# Altium project Relay via transistor.PrjPcb
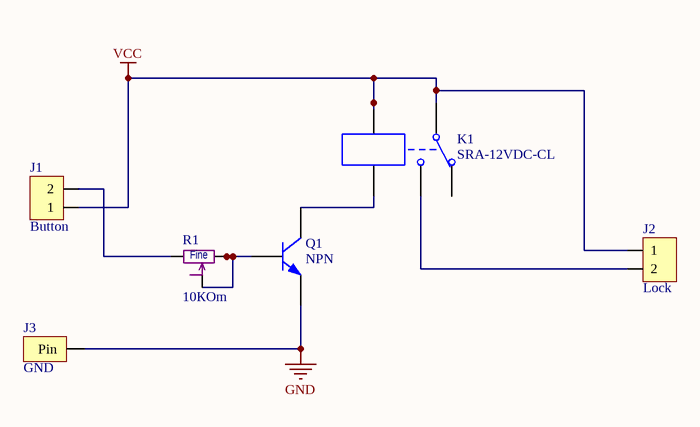
[diagram p0: Relay via transistor.SchDoc]
1 sheet, 6 parts. Net scope: global (net labels, ports and power ports of the same name join across sheets).
Board file: Relay via transistor.PcbDoc

## Sheet Relay via transistor.SchDoc
size A4

### Parts
J1  Button  [Molex Micro-Fit 3.0 - 2 pin D R]
J2  Lock  [Molex Micro-Fit 3.0 - 2 pin D R]
J3  GND  [OnePin 1.2x3]
K1  SRA-12VDC-CL  [SRA-12VDC-CL]
Q1  NPN  [TO-92 2.54 (EBC)]
R1  10КOm  [Res Adj 3362P]

### Nets
GND: J3.1(Pin) Q1.E
VCC: J1.1 J2.1 K1.2 K1.4
NetJ1_2: J1.2 R1.1
NetJ2_2: J2.2 K1.3
NetK1_5: K1.5 Q1.C
NetQ1_B: Q1.B R1.2 R1.3

Not connected (* = marked no-connect by the designer): K1 1

### Notes on the sheet
- (in symbol Res Adj 3362) Fine

### Library data of the parts
J1 J2 = Micro-Fit 2R (1x2): Horisontal, Dbl line, Male - 3mm; Part Number: 430450200; Name: Micro-Fit 3.0; URL: http://www.molex.com/molex/products/datasheet.jsp?part=active/0430450200_PCB_HEADERS.xml
J3 = OnePin Connector: Only pad
K1 = SRA-12VDC-CL: Single-Pole Dual-Throw Relay; R обм: 240 Om; I (DC = 30 V): 10A; I (AC = 240 V): 15-20A; U: 12 V; Name: SRA-12VDC-CL; DataSheet: http://tec.org.ru/_bd/12/1208_SRA.pdf
Q1 = NPN: NPN Bipolar Transistor; Published: 8-Jun-2000; LatestRevisionDate: 17-Jul-2002; LatestRevisionNote: Re-released for DXP Platform.; PackageReference: TO-226-AA; Publisher: Altium Limited; PackageDescription: TO, Flat Index; 3 In-Line, Axial Leads; Body Dia. 4.8mm; Leads 0.55 x 0.51 mm (max); Code_JEDEC: TO-226-AA
R1 = Res Adj 3362